# EAGLE schematic Schematic_v2 (EAGLE 9.7.0)
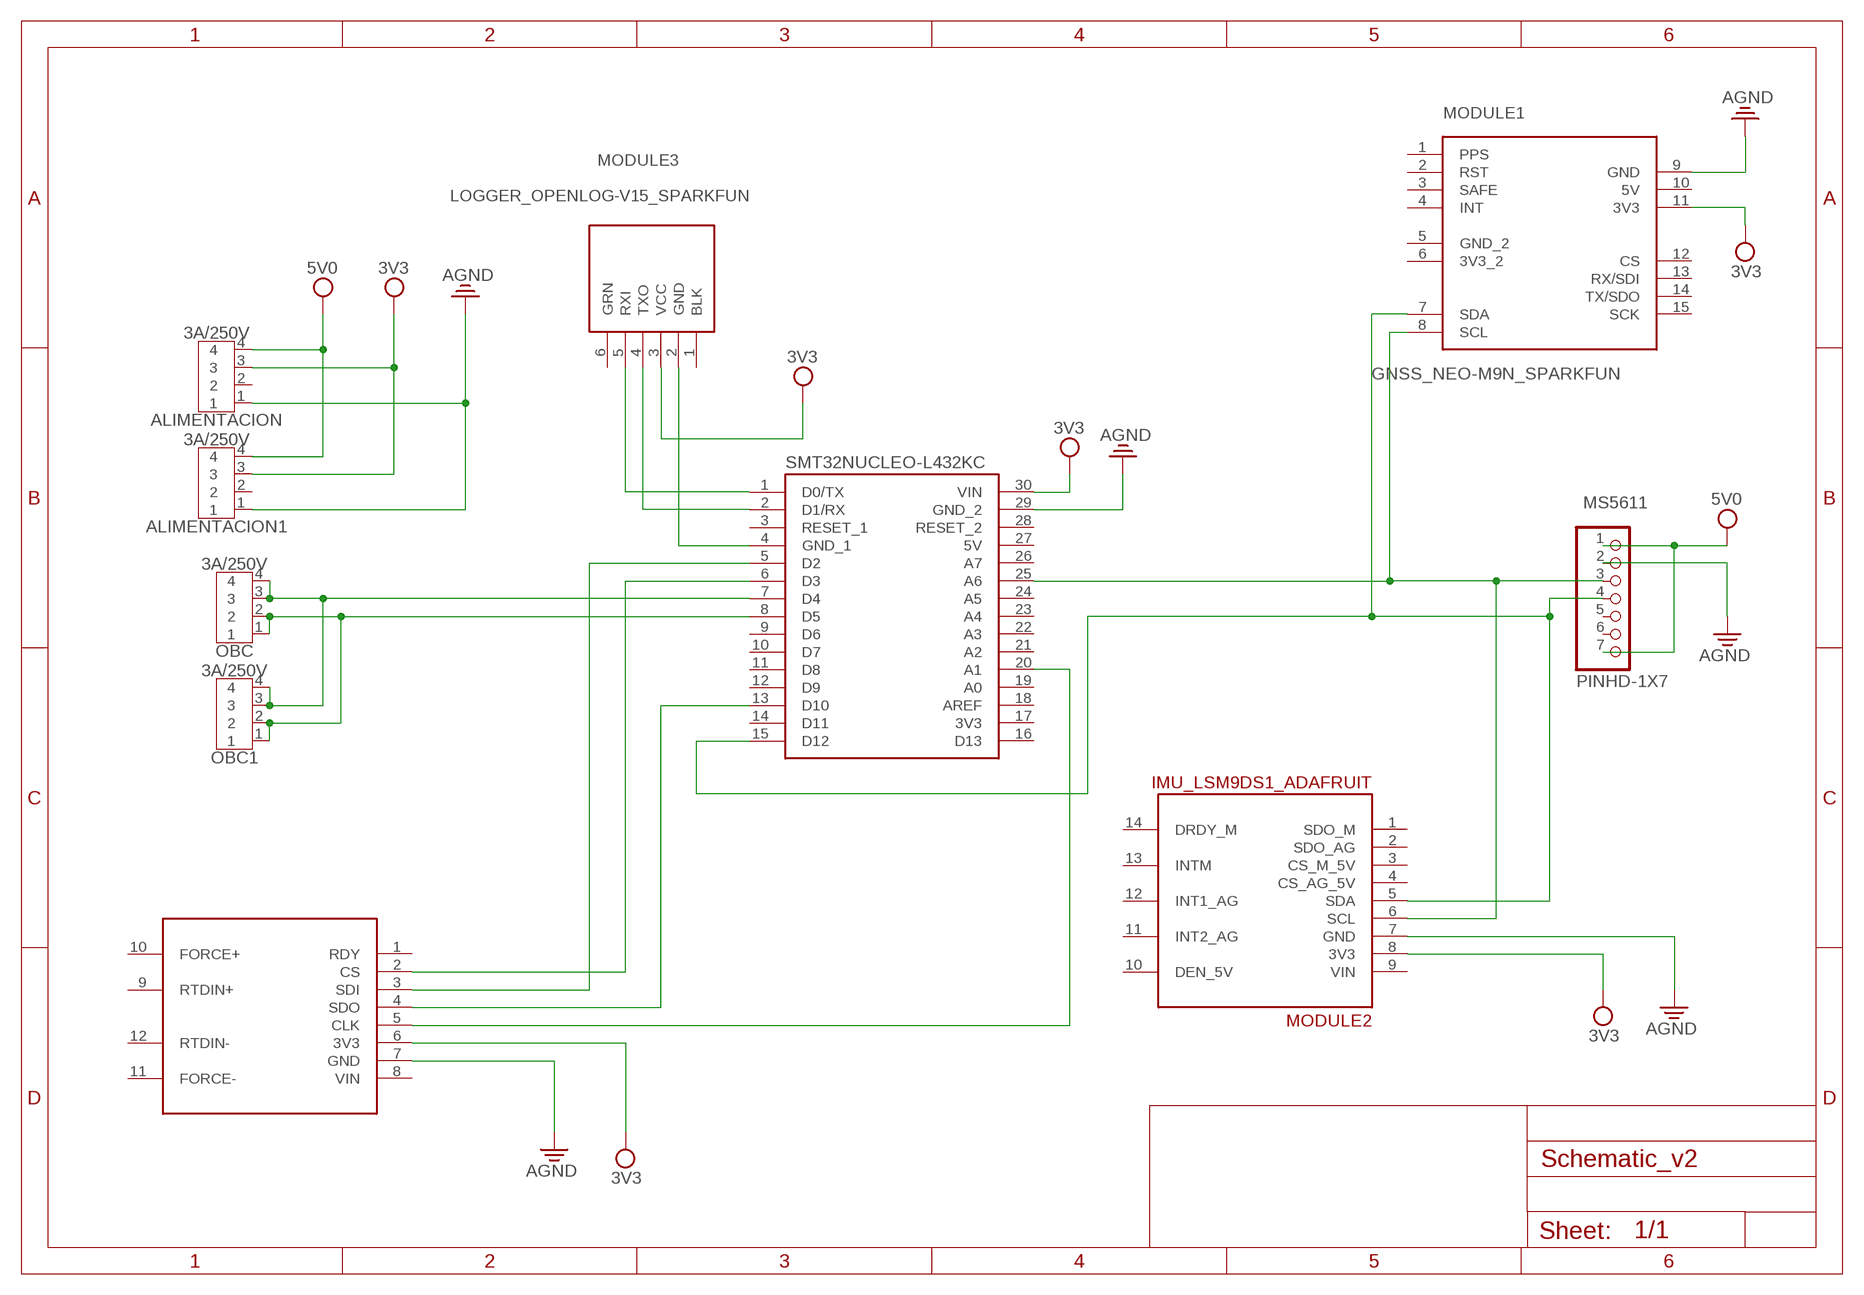
[diagram p0: schematic, sheet 1]

## Parts
ALIMENTACION  3A/250V  B4B-XH-A  [B4B-XH-A]
ALIMENTACION1  3A/250V  B4B-XH-A  [B4B-XH-A]
MODULE1  GNSS_NEO-M9N_SPARKFUN  [GNSS]
MODULE2  IMU_LSM9DS1_ADAFRUIT  [IMU]
MODULE3  LOGGER_OPENLOG-V15_SPARKFUN  [LOGGER]
MS5611  PINHD-1X7  [1X07]
OBC  3A/250V  B4B-XH-A  [B4B-XH-A]
OBC1  3A/250V  B4B-XH-A  [B4B-XH-A]
PT1000+MAX  TEMP_MAX31865_ADAFRUIT  [TEMP]
SMT32NUCLEO-L432KC  NANO_ATMEGA328  [MODULE_A000005]

## Nets
3V3: ALIMENTACION1.3 ALIMENTACION.3 MODULE1.11(3V3) MODULE2.8(3V3) MODULE3.3(VCC) PT1000+MAX.6(3V3)
5V0: ALIMENTACION1.4 ALIMENTACION.4 MS5611.1 MS5611.7 SMT32NUCLEO-L432KC.30(VIN) ; supply symbol labelled 3V3
AGND: ALIMENTACION1.1 ALIMENTACION.1 MODULE1.9(GND) MODULE2.7(GND) MS5611.2 PT1000+MAX.7(GND) SMT32NUCLEO-L432KC.29(GND_2)
GND: MODULE3.2(GND) SMT32NUCLEO-L432KC.4(GND_1)
N$1: MODULE1.7(SDA) MODULE2.5(SDA) MS5611.4 SMT32NUCLEO-L432KC.15(D12)
N$2: PT1000+MAX.5(CLK) SMT32NUCLEO-L432KC.20(A1)
N$3: PT1000+MAX.2(CS) SMT32NUCLEO-L432KC.6(D3)
N$4: MODULE3.5(RXI) SMT32NUCLEO-L432KC.1(D0/TX)
N$5: MODULE3.4(TXO) SMT32NUCLEO-L432KC.2(D1/RX)
N$6: MODULE1.8(SCL) MODULE2.6(SCL) MS5611.3 SMT32NUCLEO-L432KC.25(A6)
N$8: PT1000+MAX.3(SDI) SMT32NUCLEO-L432KC.5(D2)
N$9: PT1000+MAX.4(SDO) SMT32NUCLEO-L432KC.13(D10)
N$10: OBC1.1 OBC1.2 OBC.1 OBC.2 SMT32NUCLEO-L432KC.8(D5)
N$11: OBC1.3 OBC1.4 OBC.3 OBC.4 SMT32NUCLEO-L432KC.7(D4)
Unconnected: ALIMENTACION1.2 ALIMENTACION.2 MODULE1.1(PPS) MODULE1.2(RST) MODULE1.3(SAFE) MODULE1.4(INT) MODULE1.5(GND_2) MODULE1.6(3V3_2) MODULE1.10(5V) MODULE1.12(CS) MODULE1.13(RX/SDI) MODULE1.14(TX/SDO) MODULE1.15(SCK) MODULE2.1(SDO_M) MODULE2.2(SDO_AG) MODULE2.3(CS_M_5V) MODULE2.4(CS_AG_5V) MODULE2.9(VIN) MODULE2.10(DEN_5V) MODULE2.11(INT2_AG) MODULE2.12(INT1_AG) MODULE2.13(INTM) MODULE2.14(DRDY_M) MODULE3.1(BLK) MODULE3.6(GRN) MS5611.5 MS5611.6 PT1000+MAX.1(RDY) PT1000+MAX.8(VIN) PT1000+MAX.9(RTDIN+) PT1000+MAX.10(FORCE+) PT1000+MAX.11(FORCE-) PT1000+MAX.12(RTDIN-) SMT32NUCLEO-L432KC.3(RESET_1) SMT32NUCLEO-L432KC.9(D6) SMT32NUCLEO-L432KC.10(D7) SMT32NUCLEO-L432KC.11(D8) SMT32NUCLEO-L432KC.12(D9) SMT32NUCLEO-L432KC.14(D11) SMT32NUCLEO-L432KC.16(D13) SMT32NUCLEO-L432KC.18(AREF) SMT32NUCLEO-L432KC.19(A0) SMT32NUCLEO-L432KC.21(A2) SMT32NUCLEO-L432KC.22(A3) SMT32NUCLEO-L432KC.23(A4) SMT32NUCLEO-L432KC.24(A5) SMT32NUCLEO-L432KC.26(A7) SMT32NUCLEO-L432KC.28(RESET_2)

## Power pins joined to a net without a drawn wire
3V3: SMT32NUCLEO-L432KC.17(3V3)
5V: SMT32NUCLEO-L432KC.27(5V)

## Library data of the parts
ALIMENTACION ALIMENTACION1 OBC OBC1 = Connector:B4B-XH-A: XH Connector Top Entry - 4POS Details see: Datasheet <http://www.jst-mfg.com/product/pdf/eng/eXH.pdf>; CATEGORY: CONNECTOR; DSECRIPTION: 2.5mm pitch/disconnctable crimp style connector; MANUFACTURER: JST (XH connector); MPN: B4B-XH-A; OPERATING_TEMPERATURE: -25 C to 85 C; PART_STATUS: ACTIVE; ROHS_COMPLIANT: COMPLAINT; SERIES: B4B-XH-A; SUB_CATEGORY: Through hole; TYPE: TOP ENTRY
MODULE1 = Modulos_StratoBallon:GNSS_NEO-M9N_SPARKFUN
MODULE2 = Modulos_StratoBallon:IMU_LSM9DS1_ADAFRUIT
MODULE3 = Modulos_StratoBallon:LOGGER_OPENLOG-V15_SPARKFUN
MS5611 = Connector:PINHD-1X7: PIN HEADER; CATEGORY: CONNECTOR; SUB-CATEGORY: PIN-HEADER
PT1000+MAX = Modulos_StratoBallon:TEMP_MAX31865_ADAFRUIT
SMT32NUCLEO-L432KC = Modulos_StratoBallon:NANO_ATMEGA328: CLOCK SAW OSCILLATOR SEAM7050 T&; MANUFACTURER: Arduino; MAXIMUM_PACKAGE_HEIGHT: N/A; PARTREV: 23/03/2020; STANDARD: Manufacturer Recommendations